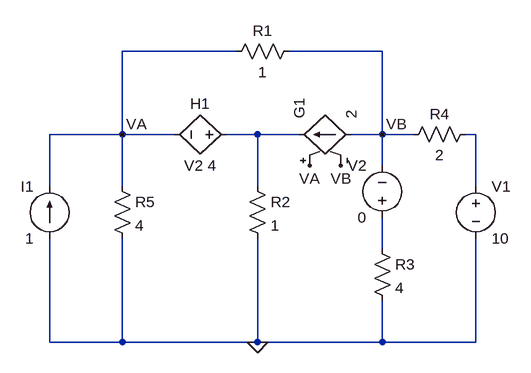
[diagram p0: schematic Draft34.asc]
Draft34.asc, the LTspice schematic file:
Version 4
SHEET 1 880 680
WIRE 160 32 -16 32
WIRE 384 32 240 32
WIRE -16 160 -16 32
WIRE -16 160 -128 160
WIRE 64 160 -16 160
WIRE 192 160 144 160
WIRE 256 160 192 160
WIRE 384 160 384 32
WIRE 384 160 336 160
WIRE 432 160 384 160
WIRE 528 160 512 160
WIRE 384 208 384 160
WIRE -128 240 -128 160
WIRE -16 240 -16 160
WIRE 192 240 192 160
WIRE 528 240 528 160
WIRE 384 336 384 288
WIRE -128 480 -128 320
WIRE -16 480 -16 320
WIRE -16 480 -128 480
WIRE 192 480 192 320
WIRE 192 480 -16 480
WIRE 384 480 384 416
WIRE 384 480 192 480
WIRE 528 480 528 320
WIRE 528 480 384 480
FLAG -16 160 VA
FLAG 272 208 VA
FLAG 384 160 VB
FLAG 320 208 VB
FLAG 192 480 0
SYMBOL res 256 16 R90
WINDOW 0 0 56 VBottom 2
WINDOW 3 32 56 VTop 2
SYMATTR InstName R1
SYMATTR Value 1
SYMBOL h 160 160 R90
WINDOW 0 -32 56 VBottom 2
WINDOW 3 32 56 VTop 2
SYMATTR InstName H1
SYMATTR Value V2 4
SYMBOL g 240 160 R270
SYMATTR InstName G1
SYMATTR Value 2
SYMBOL res 176 224 R0
SYMATTR InstName R2
SYMATTR Value 1
SYMBOL res 368 320 R0
SYMATTR InstName R3
SYMATTR Value 4
SYMBOL res 528 144 R90
WINDOW 0 0 56 VBottom 2
WINDOW 3 32 56 VTop 2
SYMATTR InstName R4
SYMATTR Value 2
SYMBOL voltage 528 224 R0
SYMATTR InstName V1
SYMATTR Value 10
SYMBOL voltage 384 304 R180
WINDOW 0 24 96 Left 2
WINDOW 3 24 16 Left 2
SYMATTR InstName V2
SYMATTR Value 0
SYMBOL res -32 224 R0
SYMATTR InstName R5
SYMATTR Value 4
SYMBOL current -128 320 R180
WINDOW 0 24 80 Left 2
WINDOW 3 24 0 Left 2
SYMATTR InstName I1
SYMATTR Value 1

The netlist it stands for:
* Draft34.asc
R1 VB VA 1
H1 N001 VA V2 4
G1 VB N001 VA VB 2
R2 N001 0 1
R3 N003 0 4
R4 N002 VB 2
V1 N002 0 10
V2 N003 VB 0
R5 VA 0 4
I1 0 VA 1
.backanno
.end